# Altium schematic sheet control_and_power.SchDoc
size A4
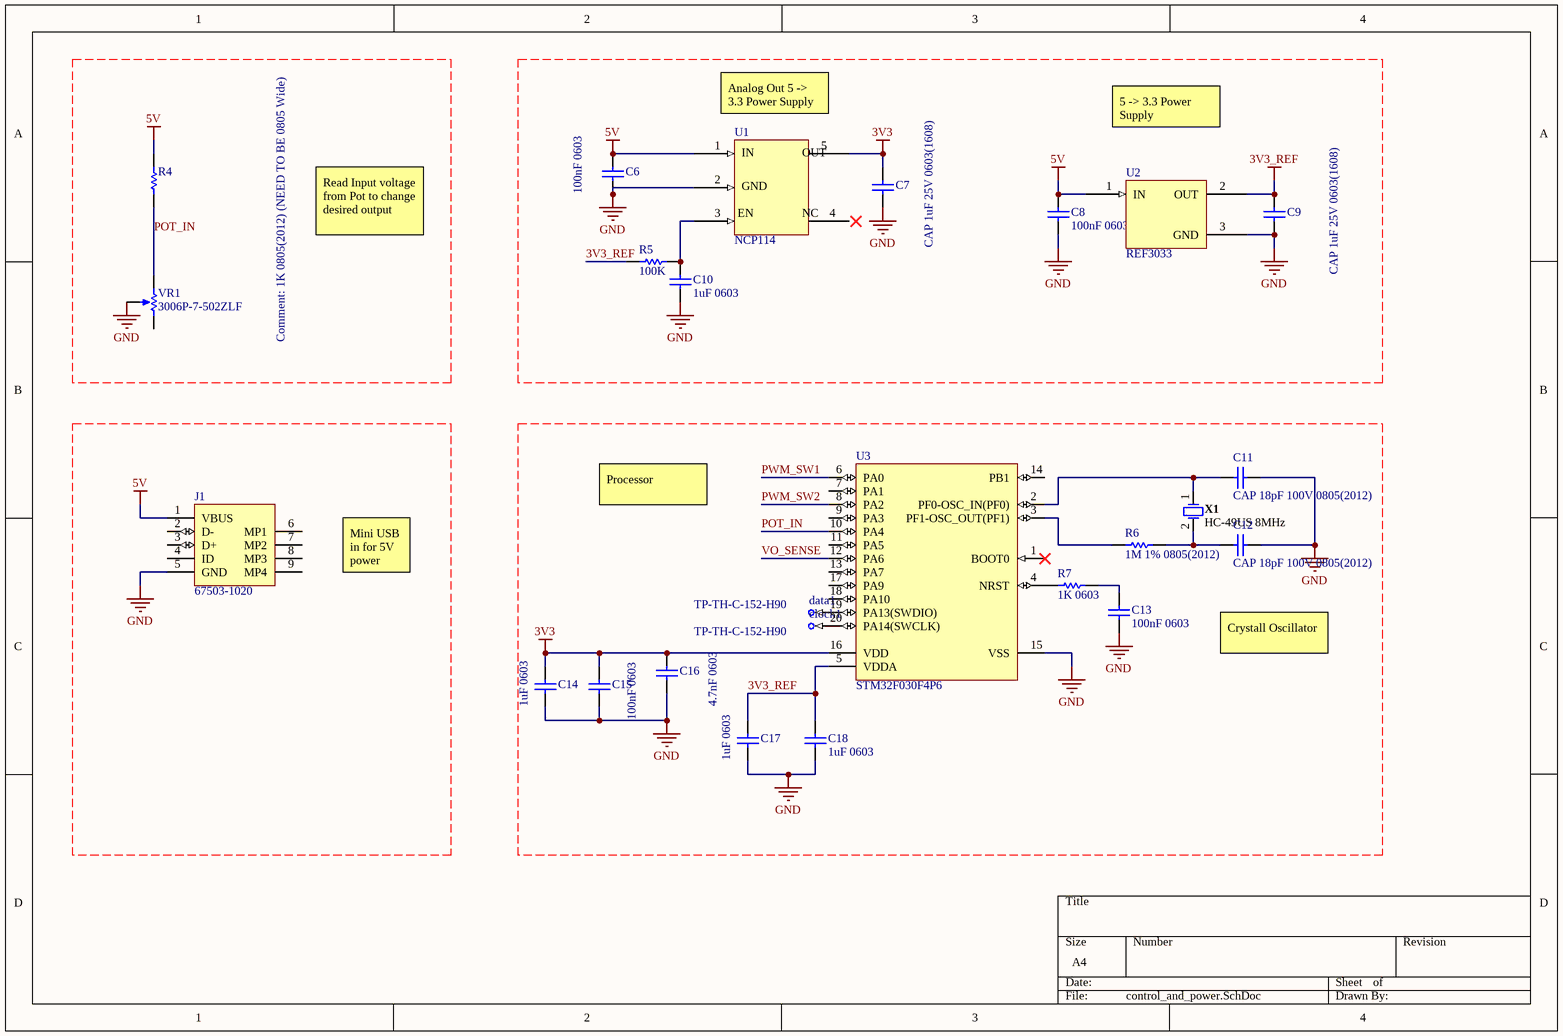
[diagram p0: control_and_power.SchDoc]

## Parts
C6  100nF 0603  [CAPC0603(1608)100_M]
C7  CAP 1uF 25V 0603(1608)  [CAPC0603(1608)100_M]
C8  100nF 0603  [CAPC0603(1608)100_M]
C9  CAP 1uF 25V 0603(1608)  [CAPC0603(1608)100_M]
C10  1uF 0603  [CAPC0603(1608)100_M]
C11  CAP 18pF 100V 0805(2012)  [CAPC0805(2012)145_M]
C12  CAP 18pF 100V 0805(2012)  [CAPC0805(2012)145_M]
C13  100nF 0603  [CAPC0603(1608)100_M]
C14  1uF 0603  [CAPC0603(1608)100_M]
C15  100nF 0603  [CAPC0603(1608)100_M]
C16  4.7nF 0603  [CAPC0603(1608)100_M]
C17  1uF 0603  [CAPC0603(1608)100_M]
C18  1uF 0603  [CAPC0603(1608)100_M]
clock1  TP-TH-C-152-H90  [TP-TH-C-152-H90]  (no BOM)
data1  TP-TH-C-152-H90  [TP-TH-C-152-H90]  (no BOM)
J1  67503-1020  [MOLX-67503-1020_V]
R4  1K 0805(2012) (NEED TO BE 0805 Wide)  [RESC0805(2012)_N]
R5  100K  [RESC0603(1608)_N]
R6  1M 1% 0805(2012)  [RESC0805(2012)_N]
R7  1K 0603  [RESC0603(1608)_N]
U1  NCP114  [SOT23-5_N]
U2  REF3033  [SOT23-3]
U3  STM32F030F4P6  [STM-TSSOP20_L]
VR1  3006P-7-502ZLF  [BOUR-3006P-3_V]
X1  HC-49US 8MHz  [JPY-HC-49US]

## Nets
3V3: C7.2 C14.2 C15.2 C16.2 U1.5(OUT) U3.16(VDD)
3V3_REF: C9.2 C17.2 C18.2 R5.1 U2.2(OUT) U3.5(VDDA)
5V: C6.2 C8.2 J1.1(VBUS) R4.2 U1.1(IN) U2.1(IN)
GND: C6.1 C7.1 C8.1 C9.1 C10.1 C11.2 C12.2 C13.1 C14.1 C15.1 C16.1 C17.1 C18.1 J1.5(GND) U1.2(GND) U2.3(GND) U3.15(VSS) VR1.2(WIPER)
POT_IN: R4.1 U3.10(PA4) VR1.3(CW)
PWM_SW1: U3.6(PA0)
PWM_SW2: U3.8(PA2)
VO_SENSE: U3.12(PA6)
NetC10_2: C10.2 R5.2 U1.3(EN)
NetC11_1: C11.1 U3.2(PF0-OSC_IN(PF0)) X1.1
NetC12_1: C12.1 R6.2 X1.2
NetC13_2: C13.2 R7.2
Netclock1_1: clock1.1 U3.20(PA14(SWCLK))
Netdata1_1: data1.1 U3.19(PA13(SWDIO))
NetR6_1: R6.1 U3.3(PF1-OSC_OUT(PF1))
NetR7_1: R7.1 U3.4(NRST)

Not connected (* = marked no-connect by the designer): J1 2(D-) 3(D+) 4(ID) 6(MP1) 7(MP2) 8(MP3) 9(MP4); U1 4(NC); U3 1(BOOT0)* 7(PA1) 9(PA3) 11(PA5) 13(PA7) 14(PB1) 17(PA9) 18(PA10); VR1 1(CCW)

## Notes on the sheet
- (near U1) Analog Out 5 -> 3.3 Power Supply
- 5 -> 3.3 Power Supply
- Read Input voltage from Pot to change desired output
- Processor
- Mini USB in for 5V power
- Crystall Oscillator

## Library data of the parts
C6-C10 C13-C18 = CMP-1035-02742-1: CAP 1uF 25V -20% to +80% 0603 (1608 Metric) Thickness 1mm SMD; Case-Metric: 1608; Case-EIA: 0603; Technology: SMT; Tolerance: -20% to +80%; Max Thickness: 1 mm; Value: 1uF; Rated Voltage: 25 V
C11 C12 = CMP-1036-01160-1: CAP 18pF 100V ±10% 0805 (2012 Metric) Thickness 1.45mm SMD; Case-Metric: 2012; Tolerance: Â±10%; Case-EIA: 0805; Value: 18pF; Max Thickness: 1.45 mm; Technology: SMT; Rated Voltage: 100 V
clock1 data1 = CMP-0484-00003-2: Test Point, Through Hole, Hole Size 0.9 mm, PCB Mount with Silkscreen Box; Manufacturer: No Vendor; PartNumber: TP-TH-C-152-H90
J1 = CMP-0411-00002-1: USB, MINI, SMD, RA KME04-USBMU03A01; Manufacturer: Molex; ComponentLink1URL: http://www.molex.com/; PartNumber: 67503-1020; Mounting Technology: Surface Mount; ComponentLink1Description: Manufacturer URL; Terminal Pitch: 0.8 mm; DatasheetVersion: Rev F, 06/2009; ComponentLink2Description: Datasheet; PackageDescription: Mini USB Connector, SMT, Righer Angle; ComponentLink2URL: http://www.molex.com/pdm_docs/sd/675031020_sd.pdf; PackageReference: 67503-1020
R4 = CMP-1013-00037-1: 30R 0.125W 5% 0805 (2012 Metric)  SMD; Case-Metric: 2012; Value: 30.00 Ohm; Case-EIA: 0805; Power: 0.125 W; Technology: SMT; Tolerance: 5 %
R5 R7 = CMP-1012-00542-1: 2K 0.1W 1% 0603 (1608 Metric)  SMD; Case-EIA: 0603; Case-Metric: 1608; Power: 0.1 W; Technology: SMT; Tolerance: 1 %
  R5: Value: 100K
  R7: Value: 1K
R6 = CMP-1013-00849-1: 1M 0.125W 1% 0805 (2012 Metric)  SMD; Value: 1000000.00 Ohm; Case-Metric: 2012; Case-EIA: 0805; Technology: SMT; Power: 0.125 W; Tolerance: 1 %
U3 = CMP-0304-00039-2: ARM Cortex-M0 32-bit MCU, 16 KB Flash, 4 KB Internal RAM, 15 I/Os, 20-pin TSSOP, -40 to 85 degC, Tube; I/Os (High Current): 15; FLASH Size (Prog) (kB): 16; Internal RAM Size (kB): 4; Supply Voltage(Vcc) min (V): 2.4; Operating Frequency(F) (Processor speed) (MHz): 48; ComponentLink2URL: http://www.st.com/st-web-ui/static/active/en/resource/technical/document/datasheet/DM00088500.pdf; Core: ARM Cortex-M0; ComponentLink2Description: Datasheet; PackageDescription: 20-Pin Thin Shrink Small Outline Package, 6.5 x 4.4 mm Body, 0.65 mm Pitch; Mounting Technology: Surface Mount; ComponentLink1URL: http://www.st.com/web/en/home.html; PackageVersion: Rev. 1, 11/2012; ComponentLink3Description: Package Specification; PartNumber: STM32F030F4P6; ComponentLink3URL: http://www.st.com/st-web-ui/static/active/en/resource/technical/document/datasheet/DM00065136.pdf; DatasheetVersion: Rev. 1; PackageReference: TSSOP20; ComponentLink1Description: Manufacturer URL; Packing: Tube
VR1 = CMP-0972-00009-1: Trimming Potentiometer, 5K Ohm +/- 10%, -55 to 125 degC, 3-Pin 19.05 x 4.83 x 6.6 mm THD, Transparent Housing, RoHS; Manufacturer: Bourns; Resistance (kOhm): 5; Resistance Tolerance: +/- 10%; Rotational Life: 200 Cycles; Number of Turns: 15; PackageDescription: 3-Pin THD, Body 19.05 x 4.83 mm, Height 6.6 mm; ComponentLink3Description: Package Specification; ComponentLink1URL: http://www.bourns.com/; PackageReference: 3006P-3; RoHS: TRUE; PackageVersion: Apr-14; PartNumber: 3006P-7-502ZLF; Mounting Technology: Through Hole; ComponentLink3URL: http://www.bourns.com/data/global/pdfs/3006.pdf; ComponentLink1Description: Manufacturer URL; Temperature Range: -55 to 125 degC; DatasheetVersion: Apr-14; ComponentLink2Description: Datasheet; ComponentLink2URL: http://www.bourns.com/data/global/pdfs/3006.pdf
X1 = CMP-2100-03645-1: Crystal, 16 MHz, +/- 30 ppm, 18 pF, -20 to 70 degC, 2-Pin THD; Manufacturer: Jing peng yuan; Datasheet URL: https://statics3.seeedstudio.com/images/opl/datasheet/306010014.pdf; Package Description: 2-Pin Throug Hole Device, Body 11.05 x 4.65 mm, Pitch 4.9 mm; Datasheet Version: 42125.0; Package Reference: HC-49US